# EAGLE design 74xx04-step-gen (EAGLE 9.4.1)
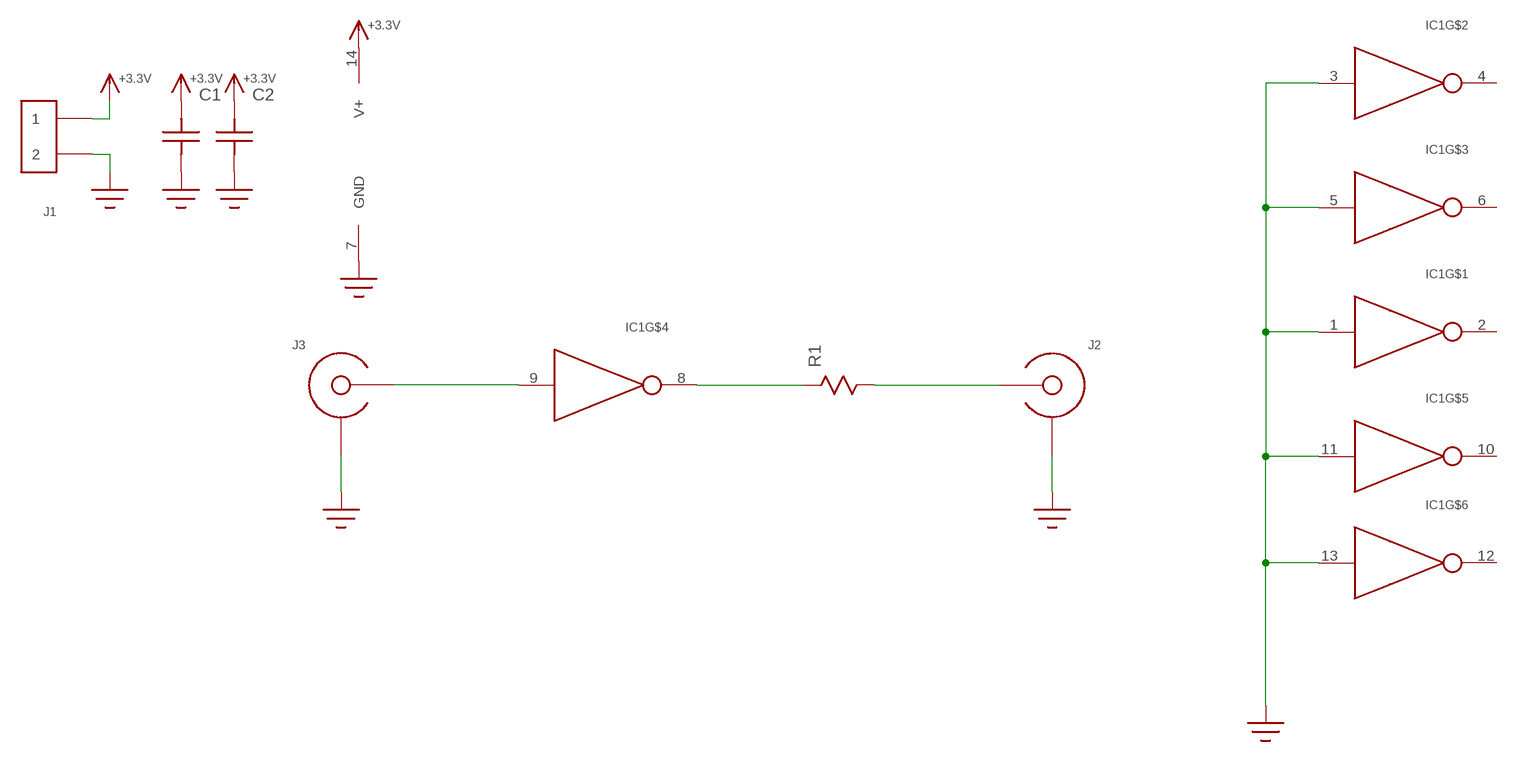
[diagram p0: schematic, sheet 1]

## Parts
C1  C1206  [1206]
C2  C0603  [C0603]
IC1  74XX04  [SOIC-14]
J1  HEADER_2PIN  [HEADER_2PIN]
J2  SMA-EDGE-LAUNCH4020_TAPER  [SMA_EDGE_LAUNCH_2L_4020_TAPER]
J3  SMA-EDGE-LAUNCH4020_TAPER  [SMA_EDGE_LAUNCH_2L_4020_TAPER]
R1  R0603  [R0603]

## Nets
+3.3V: C1.P$2 C2.P$2 IC1.14(V+) J1.1
GND: C1.P$1 C2.P$1 IC1.1(IN) IC1.3(IN) IC1.5(IN) IC1.7(GND) IC1.11(IN) IC1.13(IN) J1.2 J2.BOTTOM_GND(SHIELD) J2.GND@1(SHIELD) J2.GND@2(SHIELD) J2.GND@3(SHIELD) J2.GND@4(SHIELD) J2.GND@5(SHIELD) J2.GND@6(SHIELD) J2.GND@7(SHIELD) J2.GND@8(SHIELD) J2.GND@14(SHIELD) J2.GND@15(SHIELD) J2.GND@16(SHIELD) J2.GND@17(SHIELD) J2.GND_PAD1(SHIELD) J2.GND_PAD2(SHIELD) J2.P$1(SHIELD) J2.P$2(SHIELD) J3.BOTTOM_GND(SHIELD) J3.GND@1(SHIELD) J3.GND@2(SHIELD) J3.GND@3(SHIELD) J3.GND@4(SHIELD) J3.GND@5(SHIELD) J3.GND@6(SHIELD) J3.GND@7(SHIELD) J3.GND@8(SHIELD) J3.GND@14(SHIELD) J3.GND@15(SHIELD) J3.GND@16(SHIELD) J3.GND@17(SHIELD) J3.GND_PAD1(SHIELD) J3.GND_PAD2(SHIELD) J3.P$1(SHIELD) J3.P$2(SHIELD)
N$1 [29-6]: IC1.9(IN) J3.CENTER@1(CENTER)
N$2: IC1.8(OUT) R1.P$1
N$3 [29-6]: J2.CENTER@1(CENTER) R1.P$2
Unconnected: IC1.2(OUT) IC1.4(OUT) IC1.6(OUT) IC1.10(OUT) IC1.12(OUT)

## Library data of the parts
C1 C2 = yapo:C
IC1 = yapo:74XX04
J1 = yapo:HEADER_2PIN
J2 J3 = yapo:SMA-EDGE-LAUNCH
R1 = yapo:R

## Net classes
1 29-6: width 0.737 mm, clearance 0.152 mm

## Board
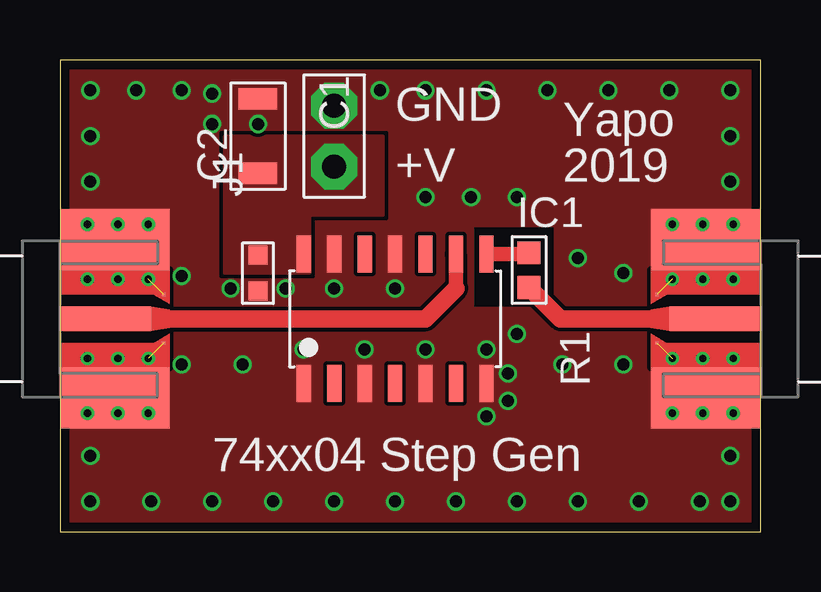
[diagram p1: board, top side]
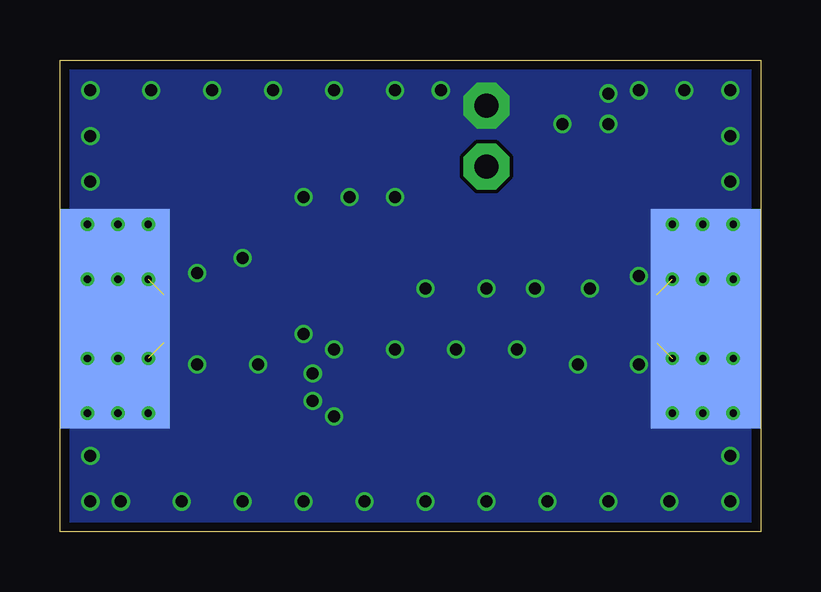
[diagram p2: board, bottom side, seen from below]

Size 29.21 x 19.68 mm. Coordinates in mm from the lower left corner, seen from the top.
Outline: 0,0 29.21,0 29.21,19.68 0,19.68 0,0
Copper layers (1*16): Top 0.035559375mm / dielectric 1.6mm / Bottom 0.035559375mm
Design rules "oshpark-2layer *": minimum track width 6mil, minimum drill 10mil, track to track 6mil, track to pad 6mil, pad to pad 6mil, via to via 6mil, smd to smd 6mil, copper to edge 15mil, drill to drill 6mil, minimum pad ring 5mil, minimum via ring 5mil, stop-mask expansion 2.5mil, vias tented up to drill 20mil, thermal gap 10mil

### Footprints (pad centres in the part's own frame; a part is rotated, then mirrored left to right if it is on the bottom)
1206 = smd 0.9 x 1.6: P$1 -1.55,0; P$2 1.55,0
C0603 = smd 0.8 x 0.8: P$1 -0.75,0; P$2 0.75,0
SOIC-14 = smd 0.6 x 1.55: 1 -3.81,-2.7; 2 -2.54,-2.7; 3 -1.27,-2.7; 4 0,-2.7; 5 1.27,-2.7; 6 2.54,-2.7; 7 3.81,-2.7; 8 3.81,2.7; 9 2.54,2.7; 10 1.27,2.7; 11 0,2.7; 12 -1.27,2.7; 13 -2.54,2.7; 14 -3.81,2.7
HEADER_2PIN = drill 1 pad 1.93 octagon: 1 -1.27,0; 2 1.27,0
SMA_EDGE_LAUNCH_2L_4020_TAPER = smd 4.572 x 9.144 bottom: BOTTOM_GND 2.286,0 | smd 3.81 x 1.016: CENTER@1 1.905,0 | drill 0.3: GND@1 1.143,3.937; GND@2 3.683,3.937; GND@3 1.143,1.651; GND@4 3.683,1.651; GND@5 1.143,-1.651; GND@6 3.683,-1.651; GND@7 1.143,-3.937; GND@8 3.683,-3.937; GND@14 2.413,3.937; GND@15 2.413,-3.937; GND@16 2.413,-1.651; GND@17 2.413,1.651 | smd 4.572 x 2.54: GND_PAD1 2.286,3.302; GND_PAD2 2.286,-3.302 | smd 0.127 x 0.127: P$1 4.318,1.016; P$2 4.318,-1.016
R0603 = smd 0.95 x 0.95: P$1 -0.725,0; P$2 0.725,0

### Placement (x,y rotation side)
C1  8.26,16.51 270 top
C2  8.26,10.79 90 top
IC1  13.97,8.89 0 top
J1  11.43,16.51 90 top
J2  29.21,8.89 180 top
J3  0,8.89 0 top
R1  19.56,10.92 270 top

### Tracks (layer width: path | path; a pad name or v marks a point on that pad's centre or on a via)
+3.3V
  pour Top (no thermals): 6.86,16.51 13.46,16.51 13.46,13.21 10.41,13.21 10.41,10.79 6.86,10.79
GND  (via drill 0.5)  (4 unrouted)
  other vias: 23.5,10.79 9.4,10.16 11.43,10.16 13.97,10.16 12.7,7.62 15.24,7.62 17.78,7.62 17.78,4.83 18.67,6.6 18.67,5.46 10.16,7.62 23.5,6.99 20.95,6.99 7.62,6.99 5.08,10.67 5.08,6.99 6.35,18.29 6.35,17.02 8.26,17.02 7.11,10.16 1.27,1.27 3.81,1.27 6.35,1.27 8.89,1.27 11.43,1.27 13.97,1.27 16.51,1.27 19.05,1.27 21.59,1.27 24.13,1.27 26.67,1.27 27.94,1.27 27.94,3.17 1.27,3.17 1.27,14.61 1.27,16.51 1.27,18.41 3.17,18.41 5.08,18.41 27.94,18.41 27.94,16.51 27.94,14.61 25.4,18.41 22.86,18.41 20.32,18.41 17.78,18.41 15.24,18.41 13.34,18.41 19.05,8.26 21.59,11.43 15.24,13.97 17.14,13.97 19.05,13.97
  pour Top (rank 2, no thermals): 0,0 29.21,0 29.21,19.68 0,19.68
  pour Bottom (rank 2, no thermals): 0,0 29.21,0 29.21,19.68 0,19.68
  cutout Top (rank 2, no thermals): 17.27,12.7 20.57,12.7 20.57,9.4 17.27,9.4
N$1
  Top 0.61: IC1.9 16.51,10.16
  Top 0.737: 16.51,10.16 15.24,8.89 J3.CENTER@1
N$2
  Top 0.61: IC1.8 19.56,11.59 R1.P$1
N$3
  Top 0.737: J2.CENTER@1 20.86,8.89 R1.P$2

### Text on the board
tPlace: GND | Yapo | +V | 2019 | 74xx04 Step Gen